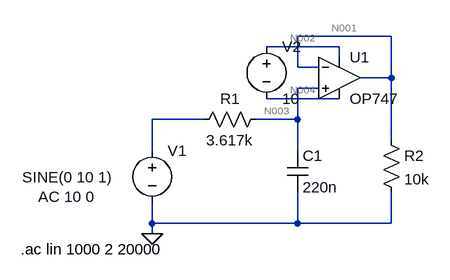
[diagram p0: schematic part1.asc]
part1.asc, the LTspice schematic file:
Version 4
SHEET 1 880 680
WIRE 432 -64 288 -64
WIRE 352 -48 240 -48
WIRE 352 -32 352 -48
WIRE 288 -16 288 -64
WIRE 320 -16 288 -16
WIRE 432 0 432 -64
WIRE 432 0 384 0
WIRE 320 16 288 16
WIRE 352 32 240 32
WIRE 144 64 64 64
WIRE 288 64 288 16
WIRE 288 64 224 64
WIRE 432 96 432 0
WIRE 64 112 64 64
WIRE 288 112 288 64
WIRE 64 224 64 192
WIRE 288 224 288 176
WIRE 288 224 64 224
WIRE 432 224 432 176
WIRE 432 224 288 224
WIRE 64 240 64 224
FLAG 64 240 0
SYMBOL cap 272 112 R0
SYMATTR InstName C1
SYMATTR Value 220n
SYMBOL res 240 48 R90
WINDOW 0 0 56 VBottom 2
WINDOW 3 32 56 VTop 2
SYMATTR InstName R1
SYMATTR Value 3.617k
SYMBOL voltage 64 96 R0
WINDOW 3 -200 57 Left 2
WINDOW 123 -175 87 Left 2
WINDOW 39 0 0 Left 0
SYMATTR InstName V1
SYMATTR Value SINE(0 10 1)
SYMATTR Value2 AC 10 0
SYMBOL res 416 80 R0
SYMATTR InstName R2
SYMATTR Value 10k
SYMBOL Opamps\\OP747 352 -64 R0
SYMATTR InstName U1
SYMBOL voltage 240 -64 R0
WINDOW 123 0 0 Left 0
WINDOW 39 0 0 Left 0
SYMATTR InstName V2
SYMATTR Value 10
TEXT -138 264 Left 2 !.ac lin 1000 2 20000

The netlist it stands for:
* part1.asc
C1 N003 0 220n
R1 N003 N005 3.617k
V1 N005 0 SINE(0 10 1) AC 10 0
R2 N001 0 10k
XU1 N003 N001 N002 N004 N001 OP747  ; pins In+ In- V+ V- OUT
V2 N002 N004 10
.ac lin 1000 2 20000
.backanno
.end

* Results of the author's LTspice run, read from the files saved beside the schematic
* Operating Point, zero values left out:
*   V(n003) = 3.636 µV
*   V(n001) = -10.05 µV
*   V(n004) = -9.191 V
*   V(n002) = 809.4 mV
*   I(R2) = -1.005 nA
*   I(R1) = 1.005 nA
*   I(V2) = -183.3 µA
*   I(V1) = 1.005 nA
*   Ix(u1:1) = -1.005 nA
*   Ix(u1:2) = 994.8 pA
*   Ix(u1:99) = 183.3 µA
*   Ix(u1:50) = -183.3 µA
*   Ix(u1:45) = 10.29 pA
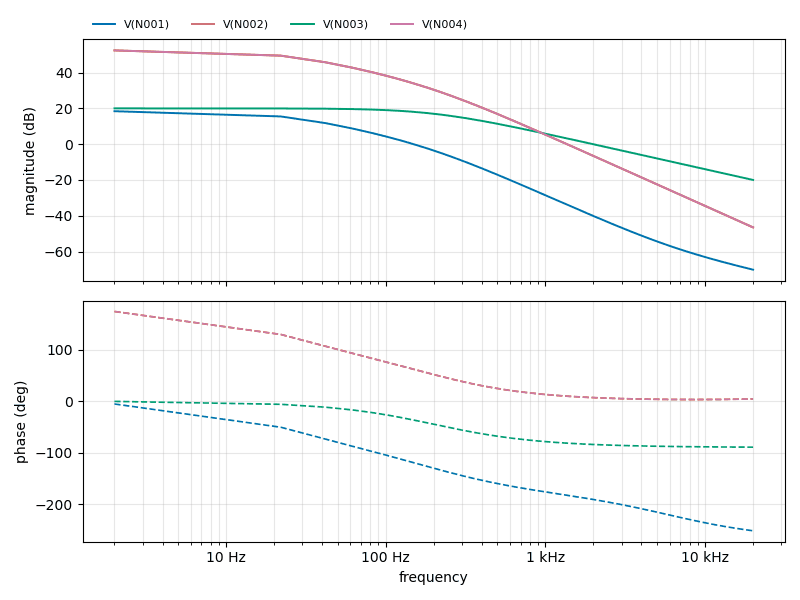
[diagram p1: AC Analysis of part1.asc, plotted from the saved traces]
* AC Analysis, 1 run:
*   V(N001): 18.41 dB at 2 Hz, -70.14 dB at 20 kHz, peak 18.41 dB at 2 Hz, 3 dB below the peak at 22.35 Hz
*   V(N002): 52.39 dB at 2 Hz, -46.51 dB at 20 kHz, peak 52.39 dB at 2 Hz, 3 dB below the peak at 22.35 Hz
*   V(N003): 20.00 dB at 2 Hz, -20.00 dB at 20 kHz, peak 20.00 dB at 2 Hz, 3 dB below the peak at 200 Hz
*   V(N004): 52.39 dB at 2 Hz, -46.51 dB at 20 kHz, peak 52.39 dB at 2 Hz, 3 dB below the peak at 22.35 Hz